# EAGLE design ASD2613 (EAGLE 6.3)
DATABASE: ./../../../../../Components/TinyCircuits_Part_Database.txt
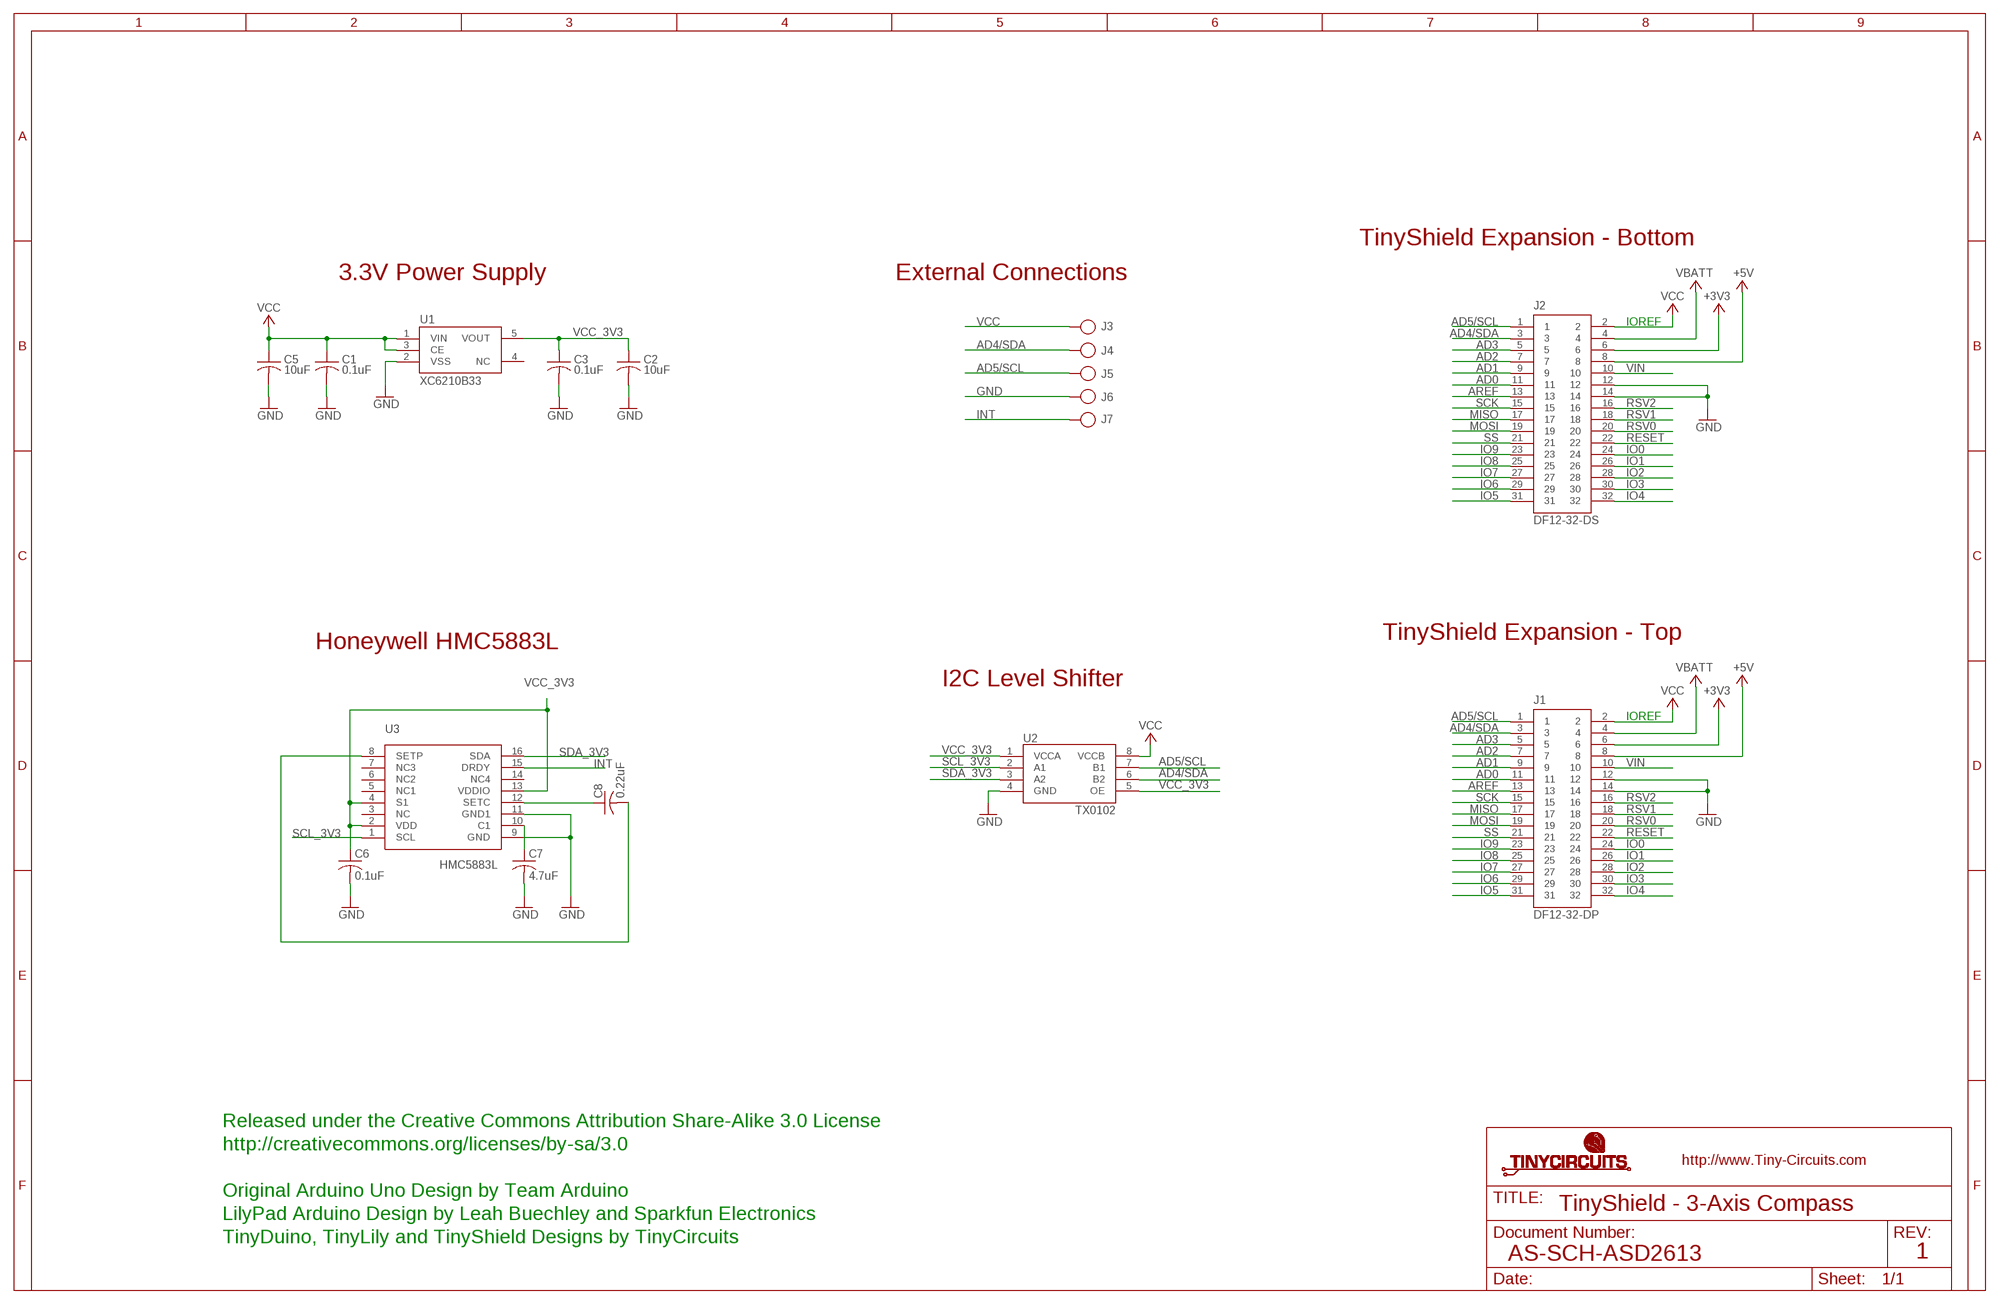
[diagram p0: schematic, sheet 1]

## Parts
C1  0.1uF  AS-ITM-00008  [C0402]
C2  10uF  AS-ITM-00045  [C0805]
C3  0.1uF  AS-ITM-00008  [C0402]
C5  10uF  AS-ITM-00045  [C0805]
C6  0.1uF  AS-ITM-00008  [C0402]
C7  4.7uF  AS-ITM-00088  [C0603]
C8  0.22uF  AS-ITM-00087  [0402]
J1  DF12-32-DP  AS-ITM-00015  [DF12-32-DP]
J2  DF12-32-DS  AS-ITM-00012  [DF12-32-DS]
J3  PIN_1X.1"  [1X.1"]
J4  PIN_1X.1"  [1X.1"]
J5  PIN_1X.1"  [1X.1"]
J6  PIN_1X.1"  [1X.1"]
J7  PIN_1X.1"  [1X.1"]
U1  XC6210B33  AS-ITM-00046  [SOT-25]
U2  TX0102  AS-ITM-00073  [DQE(R-PX2SON-N8)]
U3  HMC5883L  AS-ITM-00086  [HMC5883L]

## Nets
+3V3: J1.6 J2.6
+5V: J1.8 J2.8
AD0: J1.11 J2.11
AD1: J1.9 J2.9
AD2: J1.7 J2.7
AD3: J1.5 J2.5
AD4/SDA: J1.3 J2.3 J4.1 U2.6(B2)
AD5/SCL: J1.1 J2.1 J5.1 U2.7(B1)
AREF: J1.13 J2.13
GND: C1.2 C2.2 C3.2 C5.2 C6.2 C7.2 J1.12 J1.14 J2.12 J2.14 J6.1 U1.2(VSS) U2.4(GND) U3.9(GND) U3.11(GND1)
INT: J7.1 U3.15(DRDY)
IO0: J1.24 J2.24
IO1: J1.26 J2.26
IO2: J1.28 J2.28
IO3: J1.30 J2.30
IO4: J1.32 J2.32
IO5: J1.31 J2.31
IO6: J1.29 J2.29
IO7: J1.27 J2.27
IO8: J1.25 J2.25
IO9: J1.23 J2.23
MISO: J1.17 J2.17
MOSI: J1.19 J2.19
N$1: C8.2 U3.8(SETP)
N$2: C8.1 U3.12(SETC)
N$3: C7.1 U3.10(C1)
RESET: J1.22 J2.22
RSV0: J1.20 J2.20
RSV1: J1.18 J2.18
RSV2: J1.16 J2.16
SCK: J1.15 J2.15
SCL_3V3: U2.2(A1) U3.1(SCL)
SDA_3V3: U2.3(A2) U3.16(SDA)
SS: J1.21 J2.21
VBATT: J1.4 J2.4
VCC: C1.1 C5.1 J1.2 J2.2 J3.1 U1.1(VIN) U1.3(CE) U2.8(VCCB)
VCC_3V3: C2.1 C3.1 C6.1 U1.5(VOUT) U2.1(VCCA) U2.5(OE) U3.2(VDD) U3.4(S1) U3.13(VDDIO)
VIN: J1.10 J2.10
Unconnected: U1.4(NC) U3.3(NC) U3.5(NC1) U3.6(NC2) U3.7(NC3) U3.14(NC4)

## Notes on the sheet
- TinyShield Expansion - Bottom
- 3.3V Power Supply | External Connections
- IOREF
- TinyShield Expansion - Top
- Honeywell HMC5883L
- I2C Level Shifter
- IOREF
- Released under the Creative Commons Attribution Share-Alike 3.0 License
- http://creativecommons.org/licenses/by-sa/3.0
- Original Arduino Uno Design by Team Arduino
- TinyShield - 3-Axis Compass
- LilyPad Arduino Design by Leah Buechley and Sparkfun Electronics
- TinyDuino, TinyLily and TinyShield Designs by TinyCircuits
- AS-SCH-ASD2613 | 1

## Library data of the parts
C1 C3 C6 = tinycircuits:AS-ITM-00008: CAP CER 0.1UF 16V 10% X5R 0402; PARTNO: AS-ITM-00008
C2 C5 = tinycircuits:AS-ITM-00045: CAP CER 16UF 16V 20% X5R 0805; PARTNO: AS-ITM-00045
C7 = tinycircuits:AS-ITM-00088: CAP CER 4.7UF 6.3V 20% X5R 0603; MFGPN: C1608X5R0J475M080AB
C8 = tinycircuits:AS-ITM-00087: CAP CER 0.22UF 10V 10% X5R 0402; MFGPN: C1005X5R1A224K050BC
J1 = tinycircuits:AS-ITM-00015: CONN HEADER 32POS 3MM SMD 0.5MM; PARTNO: AS-ITM-00015
J2 = tinycircuits:AS-ITM-00012: CONN RECEPT 32POS 3MM SMD 0.5MM; PARTNO: AS-ITM-00012
J3-J7 = tinycircuits:PIN_1X.1": 1 Pin 0.100" Header
U1 = tinycircuits:AS-ITM-00046: IC REG LDO 3.3V .7A SOT-25; PARTNO: AS-ITM-00046
U2 = tinycircuits:AS-ITM-00073: TI 2-Bit Bidirectional Voltage-Level Translator; PARTNO: AS-ITM-00073; VALUE: TXS0102
U3 = tinycircuits:AS-ITM-00086: 3-axis digital magnetometer designed for low-field magnetic sensing

## Board
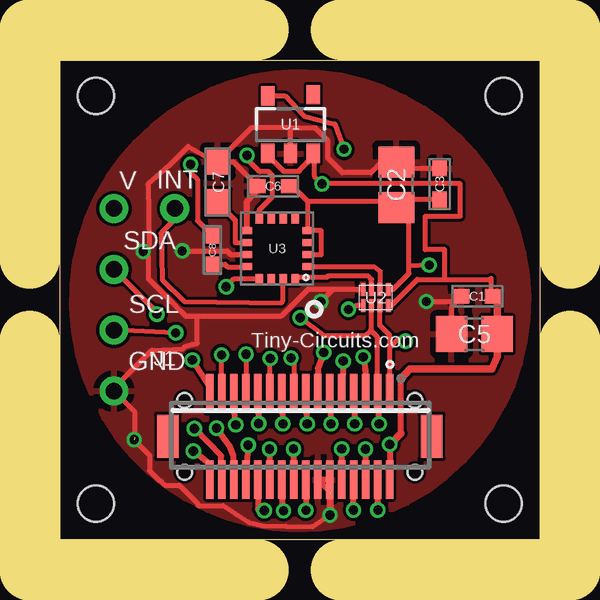
[diagram p1: board, top side]
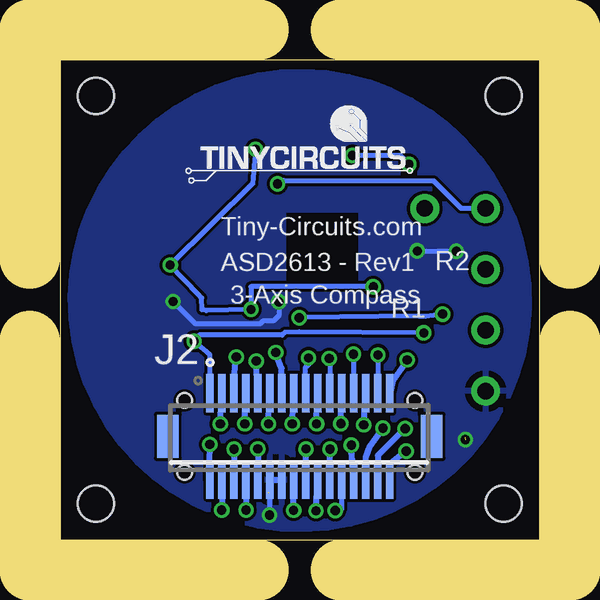
[diagram p2: board, bottom side, seen from below]

Size 20 x 20 mm. Coordinates in mm from the lower left corner, seen from the top.
Outline: 0,20 20,20 20,0 0,0 0,20
Copper layers (1*16): Top 0.035mm / dielectric 1.5mm / Bottom 0.035mm
Design rules "default *": minimum track width 5mil, minimum drill 15mil, track to track 5mil, track to pad 5mil, pad to pad 5mil, via to via 6mil, smd to smd 5mil, copper to edge 6mil, drill to drill 8mil, minimum pad ring 10mil, minimum via ring 5mil, stop-mask expansion 4mil, vias tented up to drill 25mil, thermal gap 10mil
Holes 1.5 mm at 1.5,18.5 18.5,18.5 18.5,1.5 1.5,1.5
tRestrict: area 7.6,10.6 to 10.5,13.6
bRestrict: area 7.6,10.6 to 10.5,13.6
Milling: 8 lines

### Footprints (pad centres in the part's own frame; a part is rotated, then mirrored left to right if it is on the bottom)
C0402 = smd 0.65 x 0.6: 1 -0.65,0; 2 0.65,0
C0805 = smd 1.3 x 1.5: 1 -0.95,0; 2 0.95,0
C0603 = smd 1.1 x 1: 1 -0.85,0; 2 0.85,0
0402 = smd 0.65 x 0.55: 1 -0.6,0; 2 0.6,0
DF12-32-DP = smd 0.3 x 1.6: 1 -3.75,-1.8; 2 -3.75,1.8; 3 -3.25,-1.8; 4 -3.25,1.8; 5 -2.75,-1.8; 6 -2.75,1.8; 7 -2.25,-1.8; 8 -2.25,1.8; 9 -1.75,-1.8; 10 -1.75,1.8; 11 -1.25,-1.8; 12 -1.25,1.8; 13 -0.75,-1.8; 14 -0.75,1.8; 15 -0.25,-1.8; 16 -0.25,1.8; 17 0.25,-1.8; 18 0.25,1.8; 19 0.75,-1.8; 20 0.75,1.8; 21 1.25,-1.8; 22 1.25,1.8; 23 1.75,-1.8; 24 1.75,1.8; 25 2.25,-1.8; 26 2.25,1.8; 27 2.75,-1.8; 28 2.75,1.8; 29 3.25,-1.8; 30 3.25,1.8; 31 3.75,-1.8; 32 3.75,1.8 | smd 0.9 x 1.8: F1 -5.5,0; F2 5.5,0 | hole 0.6: -4.8,1.5; 4.8,1.5
DF12-32-DS = smd 0.3 x 1.6: 1 -3.75,1.8; 2 -3.75,-1.8; 3 -3.25,1.8; 4 -3.25,-1.8; 5 -2.75,1.8; 6 -2.75,-1.8; 7 -2.25,1.8; 8 -2.25,-1.8; 9 -1.75,1.8; 10 -1.75,-1.8; 11 -1.25,1.8; 12 -1.25,-1.8; 13 -0.75,1.8; 14 -0.75,-1.8; 15 -0.25,1.8; 16 -0.25,-1.8; 17 0.25,1.8; 18 0.25,-1.8; 19 0.75,1.8; 20 0.75,-1.8; 21 1.25,1.8; 22 1.25,-1.8; 23 1.75,1.8; 24 1.75,-1.8; 25 2.25,1.8; 26 2.25,-1.8; 27 2.75,1.8; 28 2.75,-1.8; 29 3.25,1.8; 30 3.25,-1.8; 31 3.75,1.8; 32 3.75,-1.8 | smd 0.9 x 1.8: F1 -5.5,0; F2 5.5,0 | hole 0.6: -4.8,1.5; 4.8,1.5
1X.1" = drill 0.7 pad 1.016: 1 0,0
SOT-25 = smd 0.55 x 0.8: 1 -0.95,-1.2; 2 0,-1.2; 3 0.95,-1.2; 4 0.95,1.25; 5 -0.95,1.2
DQE(R-PX2SON-N8) = smd 0.2 x 0.53: 1 -0.525,-0.335; 2 -0.175,-0.335; 3 0.175,-0.335; 4 0.525,-0.335; 5 0.525,0.335; 6 0.175,0.335; 7 -0.175,0.335; 8 -0.525,0.335
HMC5883L = smd 0.45 x 0.3: 1 -1.275,0.75; 2 -1.275,0.25; 3 -1.275,-0.25; 4 -1.275,-0.75; 9 1.275,-0.75; 10 1.275,-0.25; 11 1.275,0.25; 12 1.275,0.75 | smd 0.3 x 0.45: 5 -0.75,-1.275; 6 -0.25,-1.275; 7 0.25,-1.275; 8 0.75,-1.275; 13 0.75,1.275; 14 0.25,1.275; 15 -0.25,1.275; 16 -0.75,1.275

### Placement (x,y rotation side)
C1  17.4,10.14 180 top
C2  14.03,14.79 90 top
C3  15.84,14.83 90 top
C5  17.28,8.57 180 top
C6  8.89,14.74 180 top
C7  6.58,14.91 90 top
C8  6.36,12.07 90 top
J1  10,4.3 180 top
J2  10,4.3 0 bottom
J3  2.25,13.81 0 top
J4  2.25,11.27 0 top
J5  2.25,8.73 0 top
J6  2.25,6.19 0 top
J7  4.79,13.81 0 top
U1  9.61,17.3 0 top
U2  13.17,10.1 180 top
U3  9.06,12.13 180 top
U$1  [DOCFIELD-TINYCIRCUITS-PCB]  33.91,-10 0 top  (outside the outline)

### Tracks (layer width: path | path; a pad name or v marks a point on that pad's centre or on a via)
+3V3  (via drill 0.38)
  Top 0.254: J2.6 v12.75,3.77 v12.74,3.77
  Bottom 0.254: v12.74,3.77 12.74,2.51 J2.6
+5V  (via drill 0.38)
  Top 0.254: v12.24,1.23 J2.8
  Bottom 0.254: J2.8 12.25,1.21 v12.24,1.23
AD0  (via drill 0.38)
  Top 0.254: v11.3,4.83 11.31,5.05 J2.11
  Bottom 0.254: J2.11 11.28,5.79 v11.3,4.83
AD1  (via drill 0.38)
  Top 0.254: J2.9 11.79,6.27 v11.81,7.44
  Bottom 0.254: v11.81,7.44 11.78,6.22 J2.9
AD2  (via drill 0.38)
  Top 0.254: v12.29,4.83 12.31,5.05 J2.7
  Bottom 0.254: J2.7 12.27,5.86 v12.29,4.83
AD3  (via drill 0.38)
  Top 0.254: J2.5 12.73,7.04 v12.65,7.61
  Bottom 0.254: v12.65,7.61 12.78,6.3 J2.5
AD4/SDA  (via drill 0.38)
  Top 0.203: J2.3 13.24,8.44 12.96,8.72 | 12.96,8.72 12.99,8.85 12.99,9.73 U2.6 | v10.02,9.25 10.98,8.53 11.01,8.5 12.75,8.5 12.96,8.72 | v4.04,9.4 4.11,9.41 J4.1
  Top 0.254: v13.31,4.83 13.31,5 J2.3
  Bottom 0.203: v10.02,9.25 5.02,9.31 4.75,9.31 v4.04,9.4
  Bottom 0.254: J2.3 13.28,5.86 v13.31,4.83
AD5/SCL  (via drill 0.38)
  Top 0.203: J2.1 13.75,8.01 | 13.75,8.01 13.75,8.52 13.34,8.92 U2.7 | v14.4,8.27 14.08,8.34 13.75,8.01 | v4.83,8.62 2.23,8.74 J5.1
  Bottom 0.203: v4.83,8.62 10.02,8.66 10.62,8.64 10.74,8.53 14.19,8.53 v14.4,8.27 | 14.43,8.39 v14.4,8.27 | J2.1 13.75,7.7 v14.4,8.27
AREF  (via drill 0.38)
  Top 0.254: J2.13 10.75,7.15 v11,7.8
  Bottom 0.254: v11,7.8 10.76,7.14 J2.13
GND  (via drill 0.38)  (2 unrouted)
  Top 0.203: C5.2 16.33,9.73 C1.2 16.53,9.92 v15.28,9.92 | J2.12 v11.26,1.02 10.52,0.54 9.42,0.56 8.5,0.57 7.87,0.72 7.36,1.04 6.82,1.41 5.77,1.41 5.74,1.44 5.74,1.51 4.98,2.27 4.37,2.27 4.17,2.47 4.13,2.47 3.73,2.87 3.73,3.52 v3.09,4.16 | 3.22,4.09 3.22,4.15 3.11,4.26 3.11,5.33 J6.1 2.25,6.32 3.82,7.89 5.13,7.95 5.25,8.07 5.53,8.14 5.73,8.18 5.73,9.28 5.75,9.3 | 11.3,1.95 11.3,1.14 11.29,1.13 11.29,1.09 | J2.14 11.27,1.97 11.27,1.93 11.22,1.87 11.22,0.86 11.28,0.92 11.28,1.03 11.3,1.01 11.37,1.01 | 9.62,17.18 9.61,17.18 U1.2 9.61,17.16 9.63,17.18 | 9.63,17.18 7.99,17.18 C7.2 7.22,15.76 C6.2 8.24,14.54 7.8,14.1 7.8,12.9 U3.9 7.78,14.11 8.29,14.62 8.29,14.7 7.25,15.74 6.61,15.74 6.59,15.72 6.5,15.72 5.35,16.39 4.56,15.59 3.67,14.81 3.72,12.27 v3.47,12.02 3.69,11.8 3.69,10.86 4.65,9.9 4.67,9.9 5.03,9.54 5.03,9.53 5.26,9.3 5.75,9.3 | 5.75,9.3 9.21,9.3 10.34,10.43 U2.4 11.39,10.43 v10.87,9.91 | v5.1,12.04 6.97,12.04 7.12,11.88 U3.11 | C3.2 14.03,15.48 C2.2 13.41,15.74 12.97,15.3 11.78,15.3 11.18,15.9 11.18,16.64 10.66,17.16 9.64,17.16 9.63,17.18
  Top 0.254: J2.12 J2.14
  Bottom 0.203: v11.26,1.02 11.25,1.21 J2.12 | v3.47,12.02 5.08,12.02 v5.1,12.04 | v10.87,9.91 10.87,9.34 11.09,9.12 11.52,9.12 11.65,8.99 14.35,8.99 v15.28,9.92
  Bottom 0.254: J2.12 J2.14
  pour Top: 18.49,5.61 arc180 1.54,14.32 arc180
  pour Bottom: 18.49,5.61 arc180 1.5,14.34 arc180
INT
  Top 0.203: J7.1 4.79,13.35 4.21,12.78 4.26,10.84 5.21,9.92 9.22,9.87 9.3,9.96 9.3,10.85 U3.15
IO0  (via drill 0.38)
  Top 0.254: J2.24 8.25,1.26 v8.52,1.21
  Bottom 0.203: v8.52,1.21 8.48,1.27 8.25,1.27 J2.24
  Bottom 0.254: J2.24
IO1  (via drill 0.38)
  Top 0.254: v7.85,3.94 J2.26
  Bottom 0.254: 7.85,3.66 J2.26 v7.85,3.94
IO2  (via drill 0.38)
  Top 0.254: v6.53,4.64 7.07,3.89 7.22,3.49 7.29,2.61 7.26,2.51 J2.28
  Bottom 0.254: J2.28 7.24,3.43 7.07,3.88 v6.53,4.64
IO3  (via drill 0.38)
  Top 0.254: J2.30 6.73,3.49 v5.61,4.63
  Bottom 0.254: v5.61,4.63 6.75,3.51 6.77,2.53 J2.30
IO4  (via drill 0.38)
  Top 0.254: J2.32 6.25,3.14 v5.56,3.69
  Bottom 0.254: v5.56,3.69 5.61,3.65 6.21,3.18 6.21,3.14 6.26,3.1 J2.32
IO5  (via drill 0.38)
  Top 0.254: v5.52,7.49 6.23,6.38 J2.31
  Bottom 0.254: J2.31 6.11,6.64 v5.52,7.49
IO6  (via drill 0.38)
  Top 0.203: J2.29 6.75,7.75 6.74,7.76 6.73,7.78 v6.74,7.7
  Top 0.254: J2.29
  Bottom 0.203: v6.74,7.7 6.74,6.11 J2.29
IO7  (via drill 0.38)
  Top 0.254: v7.33,4.78 7.31,4.9 J2.27
  Bottom 0.254: J2.27 7.29,5.76 v7.33,4.78
IO8  (via drill 0.38)
  Top 0.203: v7.76,7.73 7.76,6.11 J2.25
  Bottom 0.203: J2.25 v7.75,7.72 v7.76,7.73
IO9  (via drill 0.38)
  Top 0.254: v8.29,4.83 8.31,4.98 J2.23
  Bottom 0.254: J2.23 8.28,5.59 v8.29,4.83
MISO  (via drill 0.38)
  Top 0.203: v9.63,7.58 9.75,7.46 J2.17
  Bottom 0.203: J2.17 9.76,6.11 9.76,7.17 9.63,7.3 v9.63,7.58
MOSI  (via drill 0.38)
  Top 0.254: v9.3,4.83 9.31,4.95 J2.19
  Bottom 0.254: J2.19 9.27,5.76 v9.3,4.83
N$1  (via drill 0.38)
  Top 0.203: U3.8 8.31,13.74 8.86,14.29 8.86,15.18 8.71,15.34 8.32,15.34 7.79,15.88 7.79,16.01 v7.8,16.02 | v5.45,15.64 5.45,15.31 5.74,15.02 5.74,13.3 C8.2
  Bottom 0.203: v7.8,16.02 5.83,16.02 v5.45,15.64
N$2
  Top 0.203: C8.1 6.89,11.47 7,11.37 U3.12
N$3
  Top 0.203: C7.1 7.31,13.33 7.31,12.42 7.32,12.38 U3.10
RESET  (via drill 0.38)
  Top 0.254: v8.74,3.77 J2.22
  Bottom 0.254: J2.22 8.75,3.69 v8.74,3.77
RSV0  (via drill 0.38)
  Top 0.254: J2.20 9.25,1.2 v9.32,1.2
  Bottom 0.254: v9.32,1.2 J2.20
RSV1  (via drill 0.38)
  Top 0.254: v9.74,3.77 9.74,2.51 J2.18
  Bottom 0.254: J2.18 9.75,3.72 v9.74,3.77
RSV2  (via drill 0.38)
  Top 0.254: J2.16 10.25,1.16 v10.25,1.22
  Bottom 0.254: v10.25,1.22 J2.16
SCK  (via drill 0.38)
  Top 0.254: v10.31,4.83 10.31,4.98 J2.15
  Bottom 0.254: J2.15 10.29,5.66 v10.31,4.83
SCL_3V3
  Top 0.203: U3.1 13.09,11.38 13.35,11.19 13.35,10.49 U2.2
SDA_3V3
  Top 0.203: U2.3 12.99,10.85 12.86,10.98 11.17,10.98 11.12,10.94 9.89,10.94 U3.16
SS  (via drill 0.38)
  Top 0.203: J2.21 8.77,6.12 v8.77,7.55
  Bottom 0.203: v8.77,7.55 8.75,7.53 J2.21
VBATT  (via drill 0.38)
  Top 0.254: v13.25,1.23 J2.4
  Bottom 0.254: J2.4 13.25,1.24 v13.25,1.23
VCC  (via drill 0.38)
  Top 0.203: 18.23,10.32 C1.1 17.98,10.21 17.98,10.89 17.93,10.85 16.05,10.85 | 13.77,2.52 J2.2 13.73,2.67 v13.75,3.97 | U1.1 8.66,16.02 9.33,15.36 9.99,15.36 | 9.99,15.36 U1.3 | U2.8 13.81,9.76 14.91,10.85 16.05,10.85 | 16.05,10.85 16.05,12.09 15.23,12.09 15.23,13.48 16.69,13.48 16.69,14.84 v10.93,14.83 10.59,15.16 10.59,16.01 9.99,15.4 9.99,15.36
  Top 0.254: 13.77,2.52 13.77,3.97 | 14.21,4.43 14.21,6.69
  Top 0.305: 18.23,10.32 C5.1 18.23,7.64 18.02,7.12 14.59,7.12 14.21,6.69 | 13.77,3.97 14.21,4.43
  Bottom 0.203: J2.2 13.77,2.45 | 10.35,14.96 10.67,14.98 v10.93,14.83 10.8,14.96 4.41,14.96 3.27,13.81 J3.1
  Bottom 0.254: 13.77,2.45 v13.75,3.97
VCC_3V3  (via drill 0.38)
  Top 0.203: U2.1 13.89,10.43 14.56,11.1 14.56,11.4 | 14.56,11.4 14.56,13.31 C2.1 | U2.5 12.38,9.76 v12.03,9.6 | v15.4,11.45 14.56,11.4 | C6.1 9.69,14.74 10.31,14.11 | 10.31,14.11 10.31,12.9 U3.4 10.9,12.88 10.9,11.88 U3.2 | U1.5 9.38,18.5 10.18,17.66 11.47,17.33 v11.84,16.28 | 10.31,14.11 13.75,14.11 C2.1 | U3.13 7.25,10.86 v6.93,10.54 | C3.1 14.03,14.18 C2.1
  Bottom 0.203: v11.84,16.28 11.96,14.84 v15.4,11.45 14.22,10.22 14.22,10.21 14.09,10.08 14.08,9.59 13.9,9.55 v12.03,9.6 12.04,9.55 12.04,10.55 12.04,10.54 v6.93,10.54
VIN  (via drill 0.38)
  Top 0.254: J2.10 v11.76,3.78 v11.75,3.78
  Bottom 0.254: v11.75,3.78 J2.10

### Text on the board
tPlace: V | INT | SDA | SCL | Tiny-Circuits.com | GND
bPlace: Tiny-Circuits.com | ASD2613 - Rev1 | 3-Axis Compass
bNames: R2 | R1
Document: FABRICATION DRAWING | NOTES: | 1. PRINTED CIRCUIT BOARD MADE FROM NEMA GRADE FR-4 EPOXY LAMINATE | WITH 1 OUNCE COPPER PLATING AND .024 THICKNESS. | 2. ALL DIMENSIONS ARE GIVEN IN INCHES. | 3. CIRCUIT PATHS ARE FOR REFERENCE ONLY. | 4. HOLE SIZES SHOWN ARE FINISHED DIAMETERS AFTER PLATING. | 5. BOARD PLATED USING REFLOW OR SIMILAR METHOD. | 6. BOARD TO HAVE BLUE SOLDER MASK ON PLATED SURFACES USING WET FILM | 7. SILKSCREEN BOARD USING WHITE INK. | SR100 OR SR1010 EPOXY. EQUIVALENT WET OR DRY FILM MAY BE USED. | 8. THE FOLLOWING INFORMATION APPLIES TO THIS BOARD: | * 2 COPPER LAYERS | * .024 BOARD THICKNESS | * REQUIRES TOP SIDE SILKSCREEN | Released under the Creative Commons Attribution Share-Alike 3.0 License | http://creativecommons.org/licenses/by-sa/3.0 | Original Arduino Uno Design by Team Arduino | LilyPad Arduino Design by Leah Buechley and Sparkfun Electronics | TinyDuino, TinyLily and TinyShield Designs by TinyCircuits | TinyShield - 3-Axis Compass | AS-PCB-ASD2613 | 1